# EAGLE design main ver2 (EAGLE 6.5.0)
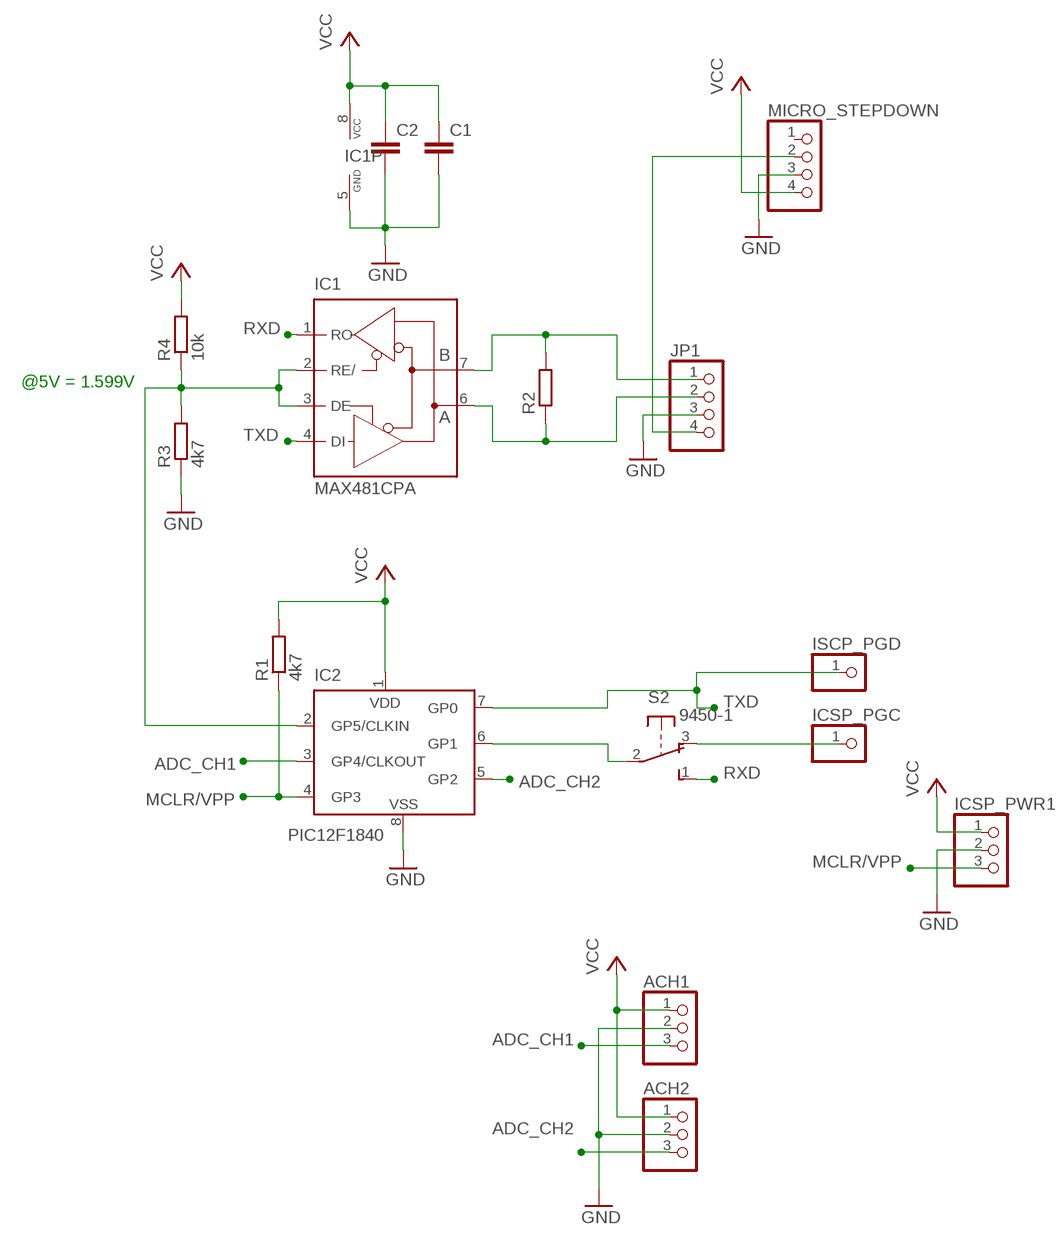
[diagram p0: schematic, sheet 1]

## Parts
ACH1  PINHD-1X3  [1X03]
ACH2  PINHD-1X3  [1X03]
C1  C-EUC0603  [C0603]
C2  C-EUC0603  [C0603]
IC1  MAX481CPA  [DIL08]
IC2  PIC12F1840  PIC12F629P  [DIL8]
ICSP_PGC  PINHD-1X1  [1X01]
ICSP_PWR1  PINHD-1X3  [1X03]
ISCP_PGD  PINHD-1X1  [1X01]
JP1  PINHD-1X4  [1X04]
MICRO_STEPDOWN  PINHD-1X4/90  [1X04/90]
R1  4k7  R-EU_R0603  [R0603]
R2  R-EU_R0603  [R0603]
R3  4k7  R-EU_R0603  [R0603]
R4  10k  R-EU_R0603  [R0603]
S2  9450-1  [9450-1]

## Nets
ADC_CH1: ACH1.3 IC2.3(GP4/CLKOUT)
ADC_CH2: ACH2.3 IC2.5(GP2)
GND: ACH1.2 ACH2.2 C1.2 C2.2 IC1.5(GND) IC2.8(VSS) ICSP_PWR1.2 JP1.3 MICRO_STEPDOWN.3 R3.1
MCLR/VPP: IC2.4(GP3) ICSP_PWR1.3 R1.1
N$1: IC1.7(B) JP1.1 R2.2
N$2: IC1.6(A) JP1.2 R2.1
N$3: JP1.4 MICRO_STEPDOWN.2
N$5: IC1.2(RE/) IC1.3(DE) IC2.2(GP5/CLKIN) R3.2 R4.1
N$6: IC2.6(GP1) S2.2(P)
N$8: ICSP_PGC.1 S2.3(O)
RXD: IC1.1(RO) S2.1(S)
TXD: IC1.4(DI) IC2.7(GP0) ISCP_PGD.1
VCC: ACH1.1 ACH2.1 C1.1 C2.1 IC1.8(VCC) IC2.1(VDD) ICSP_PWR1.1 MICRO_STEPDOWN.4 R1.2 R4.2
Unconnected: MICRO_STEPDOWN.1

## Notes on the sheet
- @5V = 1.599V

## Library data of the parts
ACH1 ACH2 ICSP_PWR1 = pinhead:PINHD-1X3: PIN HEADER
C1 C2 = rcl:C-EU: CAPACITOR, European symbol
IC1 = maxim:MAX481CPA: RS485 TRANSEIVER; MPN: MAX481CPA+; OC_FARNELL: unknown; OC_NEWARK: 99K3445
IC2 = microchip:PIC12F6*: Data Sheet 8-Pin FLASH-Based 8-Bit CMOS Microcontrollers Source: http://www.microchip.com .. 41190c.pdf; MF: MICROCHIP; MPN: PIC12F629-I/P; OC_FARNELL: 1292253; OC_NEWARK: 67K0822
ICSP_PGC ISCP_PGD = pinhead:PINHD-1X1: PIN HEADER
JP1 MICRO_STEPDOWN = pinhead:PINHD-1X4: PIN HEADER
R1-R4 = rcl:R-EU_: RESISTOR, European symbol
S2 = switch-misc:9450-1: MARQUARDT SWITCH

## Board
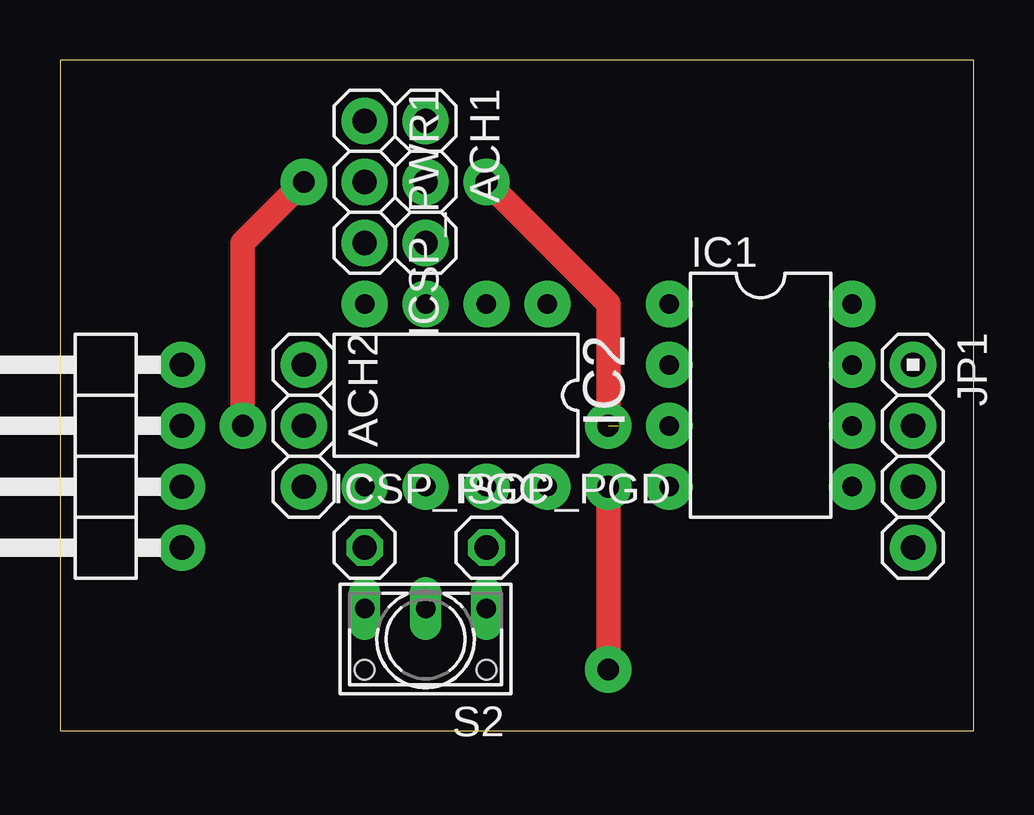
[diagram p1: board, top side]
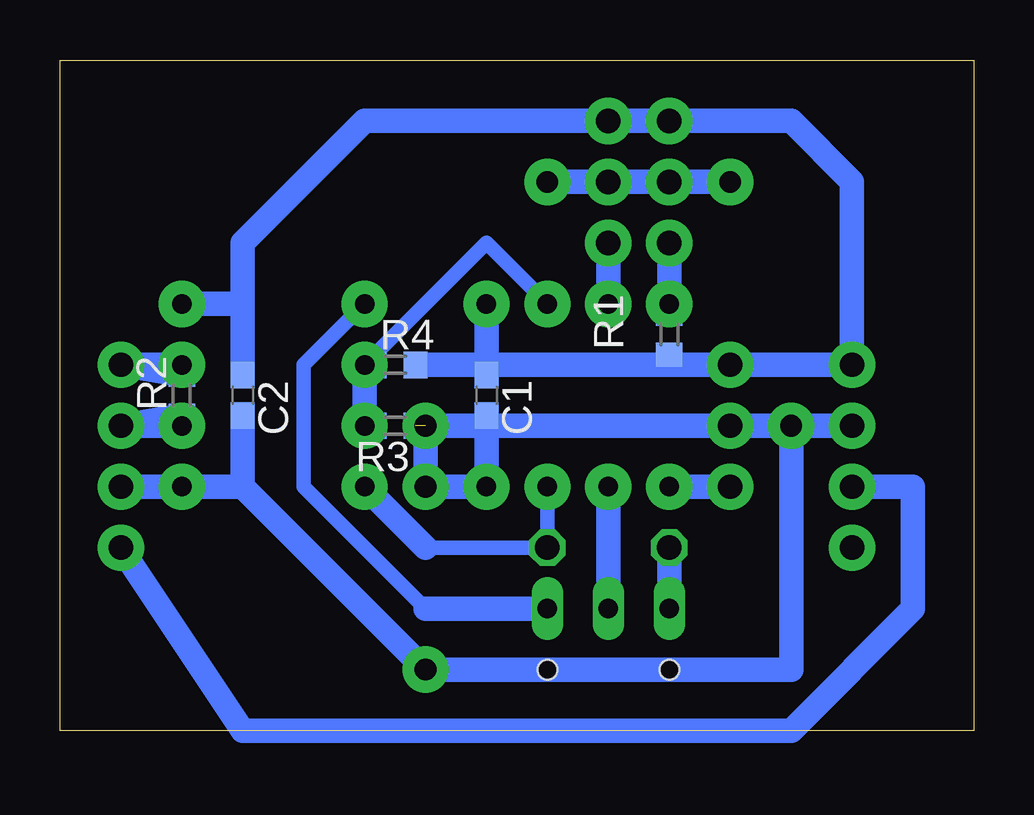
[diagram p2: board, bottom side, seen from below]

Size 38.1 x 27.94 mm. Coordinates in mm from the lower left corner, seen from the top.
Outline: 0,0 38.1,0 38.1,27.94 0,27.94 0,0
Copper layers (1*16): Top 0.035mm / dielectric 1.5mm / Bottom 0.035mm
Design rules "default": minimum track width 10mil, minimum drill 24mil, track to track 8mil, track to pad 8mil, pad to pad 8mil, via to via 8mil, smd to smd 8mil, copper to edge 40mil, drill to drill 8mil, minimum pad ring 10mil, minimum via ring 8mil, stop-mask expansion 4mil, vias tented up to drill 0mil, thermal gap 10mil

### Footprints (pad centres in the part's own frame; a part is rotated, then mirrored left to right if it is on the bottom)
1X03 = drill 1.016 pad 1.93: 1 -2.54,0; 2 0,0; 3 2.54,0
C0603 = smd 1.1 x 1: 1 -0.85,0; 2 0.85,0
DIL08 = drill 0.813 pad 1.93: 1 -3.81,-3.81; 2 -1.27,-3.81; 3 1.27,-3.81; 4 3.81,-3.81; 5 3.81,3.81; 6 1.27,3.81; 7 -1.27,3.81; 8 -3.81,3.81
DIL8 = drill 0.813 pad 1.93: 1 -3.81,-3.81; 2 -1.27,-3.81; 3 1.27,-3.81; 4 3.81,-3.81; 5 3.81,3.81; 6 1.27,3.81; 7 -1.27,3.81; 8 -3.81,3.81
1X01 = drill 1.016 octagon: 1 0,0
1X04 = drill 1.016 pad 1.93: 1 -3.81,0; 2 -1.27,0; 3 1.27,0; 4 3.81,0
1X04/90 = drill 1.016 pad 1.93: 1 -3.81,-3.81; 2 -1.27,-3.81; 3 1.27,-3.81; 4 3.81,-3.81
R0603 = smd 1 x 1.1: 1 -0.85,0; 2 0.85,0
9450-1 = drill 0.813 long: 1 -2.54,-1.27; 2 0,-1.27; 3 2.54,-1.27 | hole 0.813: 2.54,1.27; -2.54,1.27

### Placement (x,y rotation side)
ACH1  15.24,22.86 270 top
ACH2  10.16,12.7 270 top
C1  20.32,13.97 270 bottom
C2  30.48,13.97 270 bottom
IC1  29.21,13.97 270 top
IC2  16.51,13.97 180 top
ICSP_PGC  12.7,7.62 0 top
ICSP_PWR1  12.7,22.86 270 top
ISCP_PGD  17.78,7.62 0 top
JP1  35.56,11.43 270 top
MICRO_STEPDOWN  1.27,11.43 90 top
R1  12.7,16.51 270 bottom
R2  33.02,13.97 90 bottom
R3  24.13,12.7 180 bottom
R4  24.13,15.24 0 bottom
S2  15.24,3.81 180 top

### Tracks (layer width: path | path; a pad name or v marks a point on that pad's centre or on a via)
ADC_CH1
  Bottom 1.016: ACH1.3 IC2.3
ADC_CH2
  Bottom 1.016: ACH2.3 IC2.5
GND  (via drill 0.9 pad 1.93)  (1 unrouted)
  Top 1.016: v22.86,10.16 v22.86,2.54 | v17.78,22.86 22.86,17.78 v22.86,12.7 | v10.16,22.86 7.62,20.32 v7.62,12.7
  Bottom 1.016: C1.2 20.32,12.7 | 20.32,12.7 IC2.8 v22.86,10.16 v22.86,12.7 20.32,12.7 | C2.2 30.48,10.16 | 30.48,10.16 IC1.5 JP1.3 | 30.48,10.16 v22.86,2.54 7.62,2.54 v7.62,12.7 | 20.32,12.7 ACH2.2 v7.62,12.7 | v17.78,22.86 ACH1.2 ICSP_PWR1.2 v10.16,22.86 | MICRO_STEPDOWN.3 v7.62,12.7
MCLR/VPP
  Bottom 1.016: ICSP_PWR1.3 IC2.4 R1.1
N$1
  Bottom 1.016: IC1.7 JP1.1 R2.2
N$2
  Bottom 1.016: IC1.6 JP1.2 R2.1
N$3
  Bottom 1.016: MICRO_STEPDOWN.2 2.54,10.16 2.54,5.08 7.62,0 30.48,0 JP1.4
N$5
  Bottom 0.61: IC2.2 20.32,20.32 IC1.2 R4.1 | R3.2 IC1.3
  Bottom 1.016: IC1.3 IC1.2
N$6
  Bottom 1.016: IC2.6 S2.2
N$8
  Bottom 1.016: ICSP_PGC.1 S2.3
RXD
  Bottom 0.61: 22.86,5.08 27.94,10.16 27.94,15.24 IC1.1
  Bottom 1.016: S2.1 22.86,5.08
TXD
  Bottom 0.61: 22.86,7.62 ISCP_PGD.1 IC2.7
  Bottom 1.016: IC1.4 22.86,7.62
VCC
  Bottom 1.016: C1.1 20.32,15.24 | 20.32,15.24 IC2.1 | C2.1 30.48,17.78 | 30.48,17.78 IC1.8 | 30.48,17.78 30.48,20.32 25.4,25.4 ACH1.1 ICSP_PWR1.1 7.62,25.4 5.08,22.86 MICRO_STEPDOWN.4 ACH2.1 12.7,15.24 | 12.7,15.24 20.32,15.24 | R1.2 12.7,15.24 | 20.32,15.24 R4.2